# Altium schematic sheet TRANSFORMER_RJ45.SchDoc
size 386 x 246 mm
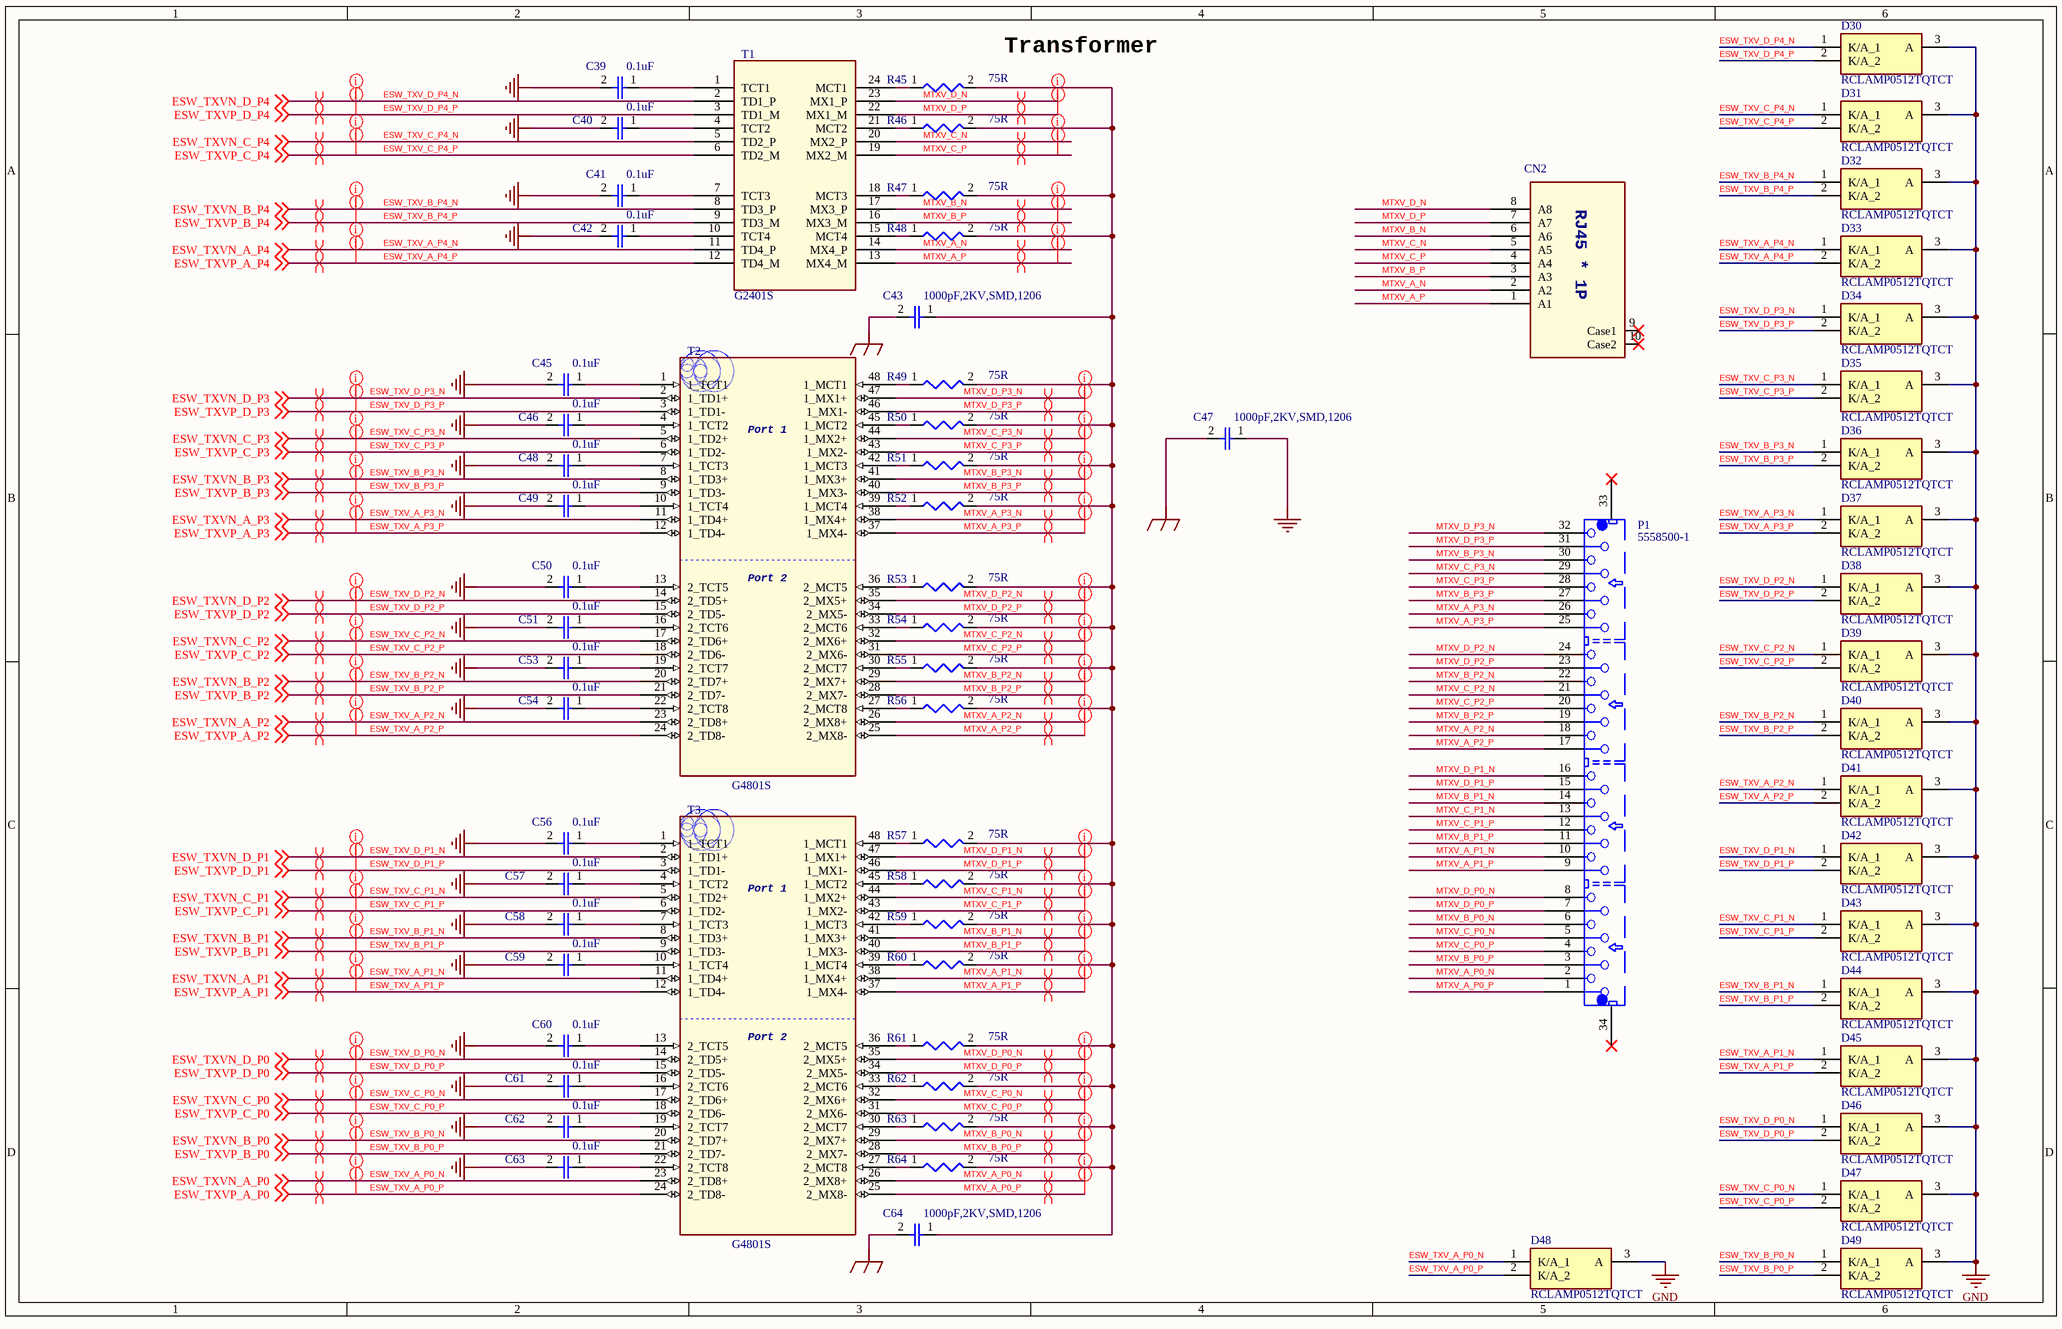
[diagram p0: TRANSFORMER_RJ45.SchDoc]

## Parts
C39  0.1uF  [0402-C]
C40  0.1uF  [0402-C]
C41  0.1uF  [0402-C]
C42  0.1uF  [0402-C]
C43  1000pF,2KV,SMD,1206  [1206-C]
C45  0.1uF  [0402-C]
C46  0.1uF  [0402-C]
C47  1000pF,2KV,SMD,1206  [1206-C]
C48  0.1uF  [0402-C]
C49  0.1uF  [0402-C]
C50  0.1uF  [0402-C]
C51  0.1uF  [0402-C]
C53  0.1uF  [0402-C]
C54  0.1uF  [0402-C]
C56  0.1uF  [0402-C]
C57  0.1uF  [0402-C]
C58  0.1uF  [0402-C]
C59  0.1uF  [0402-C]
C60  0.1uF  [0402-C]
C61  0.1uF  [0402-C]
C62  0.1uF  [0402-C]
C63  0.1uF  [0402-C]
C64  1000pF,2KV,SMD,1206  [1206-C]
CN2  6116518-1  [BEL_SS-6488-NF]  (value not drawn)
D30  RCLAMP0512TQTCT  [RCLAMP0512TQTCT]
D31  RCLAMP0512TQTCT  [RCLAMP0512TQTCT]
D32  RCLAMP0512TQTCT  [RCLAMP0512TQTCT]
D33  RCLAMP0512TQTCT  [RCLAMP0512TQTCT]
D34  RCLAMP0512TQTCT  [RCLAMP0512TQTCT]
D35  RCLAMP0512TQTCT  [RCLAMP0512TQTCT]
D36  RCLAMP0512TQTCT  [RCLAMP0512TQTCT]
D37  RCLAMP0512TQTCT  [RCLAMP0512TQTCT]
D38  RCLAMP0512TQTCT  [RCLAMP0512TQTCT]
D39  RCLAMP0512TQTCT  [RCLAMP0512TQTCT]
D40  RCLAMP0512TQTCT  [RCLAMP0512TQTCT]
D41  RCLAMP0512TQTCT  [RCLAMP0512TQTCT]
D42  RCLAMP0512TQTCT  [RCLAMP0512TQTCT]
D43  RCLAMP0512TQTCT  [RCLAMP0512TQTCT]
D44  RCLAMP0512TQTCT  [RCLAMP0512TQTCT]
D45  RCLAMP0512TQTCT  [RCLAMP0512TQTCT]
D46  RCLAMP0512TQTCT  [RCLAMP0512TQTCT]
D47  RCLAMP0512TQTCT  [RCLAMP0512TQTCT]
D48  RCLAMP0512TQTCT  [RCLAMP0512TQTCT]
D49  RCLAMP0512TQTCT  [RCLAMP0512TQTCT]
P1  5558500-1  [CONN_ARJ14A-MESA-MU2]
R45  75R  [0402-R]
R46  75R  [0402-R]
R47  75R  [0402-R]
R48  75R  [0402-R]
R49  75R  [0402-R]
R50  75R  [0402-R]
R51  75R  [0402-R]
R52  75R  [0402-R]
R53  75R  [0402-R]
R54  75R  [0402-R]
R55  75R  [0402-R]
R56  75R  [0402-R]
R57  75R  [0402-R]
R58  75R  [0402-R]
R59  75R  [0402-R]
R60  75R  [0402-R]
R61  75R  [0402-R]
R62  75R  [0402-R]
R63  75R  [0402-R]
R64  75R  [0402-R]
T1  G2401S  [SOP127P1600X572-24N]
T2  G4801S  [NV6]
T3  G4801S  [NV6]

## Nets
CHGND_GE_A: C43.2 C47.2 C64.2
GND: C39.2 C40.2 C41.2 C42.2 C45.2 C46.2 C47.1 C48.2 C49.2 C50.2 C51.2 C53.2 C54.2 C56.2 C57.2 C58.2 C59.2 C60.2 C61.2 C62.2 C63.2 D30.3(A) D31.3(A) D32.3(A) D33.3(A) D34.3(A) D35.3(A) D36.3(A) D37.3(A) D38.3(A) D39.3(A) D40.3(A) D41.3(A) D42.3(A) D43.3(A) D44.3(A) D45.3(A) D46.3(A) D47.3(A) D48.3(A) D49.3(A)
ESW_TXV_A_P0_N: D48.1(K/A_1) T3.23(2_TD8+) ; off-sheet ESW_TXVN_A_P0  [also labelled ESW_TXVN_A_P0]
ESW_TXV_A_P0_P: D48.2(K/A_2) T3.24(2_TD8-) ; off-sheet ESW_TXVP_A_P0  [also labelled ESW_TXVP_A_P0]
ESW_TXV_A_P1_N: D45.1(K/A_1) T3.11(1_TD4+) ; off-sheet ESW_TXVN_A_P1  [also labelled ESW_TXVN_A_P1]
ESW_TXV_A_P1_P: D45.2(K/A_2) T3.12(1_TD4-) ; off-sheet ESW_TXVP_A_P1  [also labelled ESW_TXVP_A_P1]
ESW_TXV_A_P2_N: D41.1(K/A_1) T2.23(2_TD8+) ; off-sheet ESW_TXVN_A_P2  [also labelled ESW_TXVN_A_P2]
ESW_TXV_A_P2_P: D41.2(K/A_2) T2.24(2_TD8-) ; off-sheet ESW_TXVP_A_P2  [also labelled ESW_TXVP_A_P2]
ESW_TXV_A_P3_N: D37.1(K/A_1) T2.11(1_TD4+) ; off-sheet ESW_TXVN_A_P3  [also labelled ESW_TXVN_A_P3]
ESW_TXV_A_P3_P: D37.2(K/A_2) T2.12(1_TD4-) ; off-sheet ESW_TXVP_A_P3  [also labelled ESW_TXVP_A_P3]
ESW_TXV_A_P4_N: D33.1(K/A_1) T1.11(TD4_P) ; off-sheet ESW_TXVN_A_P4  [also labelled ESW_TXVN_A_P4]
ESW_TXV_A_P4_P: D33.2(K/A_2) T1.12(TD4_M) ; off-sheet ESW_TXVP_A_P4  [also labelled ESW_TXVP_A_P4]
ESW_TXV_B_P0_N: D49.1(K/A_1) T3.20(2_TD7+) ; off-sheet ESW_TXVN_B_P0  [also labelled ESW_TXVN_B_P0]
ESW_TXV_B_P0_P: D49.2(K/A_2) T3.21(2_TD7-) ; off-sheet ESW_TXVP_B_P0  [also labelled ESW_TXVP_B_P0]
ESW_TXV_B_P1_N: D44.1(K/A_1) T3.8(1_TD3+) ; off-sheet ESW_TXVN_B_P1  [also labelled ESW_TXVN_B_P1]
ESW_TXV_B_P1_P: D44.2(K/A_2) T3.9(1_TD3-) ; off-sheet ESW_TXVP_B_P1  [also labelled ESW_TXVP_B_P1]
ESW_TXV_B_P2_N: D40.1(K/A_1) T2.20(2_TD7+) ; off-sheet ESW_TXVN_B_P2  [also labelled ESW_TXVN_B_P2]
ESW_TXV_B_P2_P: D40.2(K/A_2) T2.21(2_TD7-) ; off-sheet ESW_TXVP_B_P2  [also labelled ESW_TXVP_B_P2]
ESW_TXV_B_P3_N: D36.1(K/A_1) T2.8(1_TD3+) ; off-sheet ESW_TXVN_B_P3  [also labelled ESW_TXVN_B_P3]
ESW_TXV_B_P3_P: D36.2(K/A_2) T2.9(1_TD3-) ; off-sheet ESW_TXVP_B_P3  [also labelled ESW_TXVP_B_P3]
ESW_TXV_B_P4_N: D32.1(K/A_1) T1.8(TD3_P) ; off-sheet ESW_TXVN_B_P4  [also labelled ESW_TXVN_B_P4]
ESW_TXV_B_P4_P: D32.2(K/A_2) T1.9(TD3_M) ; off-sheet ESW_TXVP_B_P4  [also labelled ESW_TXVP_B_P4]
ESW_TXV_C_P0_N: D47.1(K/A_1) T3.17(2_TD6+) ; off-sheet ESW_TXVN_C_P0  [also labelled ESW_TXVN_C_P0]
ESW_TXV_C_P0_P: D47.2(K/A_2) T3.18(2_TD6-) ; off-sheet ESW_TXVP_C_P0  [also labelled ESW_TXVP_C_P0]
ESW_TXV_C_P1_N: D43.1(K/A_1) T3.5(1_TD2+) ; off-sheet ESW_TXVN_C_P1  [also labelled ESW_TXVN_C_P1]
ESW_TXV_C_P1_P: D43.2(K/A_2) T3.6(1_TD2-) ; off-sheet ESW_TXVP_C_P1  [also labelled ESW_TXVP_C_P1]
ESW_TXV_C_P2_N: D39.1(K/A_1) T2.17(2_TD6+) ; off-sheet ESW_TXVN_C_P2  [also labelled ESW_TXVN_C_P2]
ESW_TXV_C_P2_P: D39.2(K/A_2) T2.18(2_TD6-) ; off-sheet ESW_TXVP_C_P2  [also labelled ESW_TXVP_C_P2]
ESW_TXV_C_P3_N: D35.1(K/A_1) T2.5(1_TD2+) ; off-sheet ESW_TXVN_C_P3  [also labelled ESW_TXVN_C_P3]
ESW_TXV_C_P3_P: D35.2(K/A_2) T2.6(1_TD2-) ; off-sheet ESW_TXVP_C_P3  [also labelled ESW_TXVP_C_P3]
ESW_TXV_C_P4_N: D31.1(K/A_1) T1.5(TD2_P) ; off-sheet ESW_TXVN_C_P4  [also labelled ESW_TXVN_C_P4]
ESW_TXV_C_P4_P: D31.2(K/A_2) T1.6(TD2_M) ; off-sheet ESW_TXVP_C_P4  [also labelled ESW_TXVP_C_P4]
ESW_TXV_D_P0_N: D46.1(K/A_1) T3.14(2_TD5+) ; off-sheet ESW_TXVN_D_P0  [also labelled ESW_TXVN_D_P0]
ESW_TXV_D_P0_P: D46.2(K/A_2) T3.15(2_TD5-) ; off-sheet ESW_TXVP_D_P0  [also labelled ESW_TXVP_D_P0]
ESW_TXV_D_P1_N: D42.1(K/A_1) T3.2(1_TD1+) ; off-sheet ESW_TXVN_D_P1  [also labelled ESW_TXVN_D_P1]
ESW_TXV_D_P1_P: D42.2(K/A_2) T3.3(1_TD1-) ; off-sheet ESW_TXVP_D_P1  [also labelled ESW_TXVP_D_P1]
ESW_TXV_D_P2_N: D38.1(K/A_1) T2.14(2_TD5+) ; off-sheet ESW_TXVN_D_P2  [also labelled ESW_TXVN_D_P2]
ESW_TXV_D_P2_P: D38.2(K/A_2) T2.15(2_TD5-) ; off-sheet ESW_TXVP_D_P2  [also labelled ESW_TXVP_D_P2]
ESW_TXV_D_P3_N: D34.1(K/A_1) T2.2(1_TD1+) ; off-sheet ESW_TXVN_D_P3  [also labelled ESW_TXVN_D_P3]
ESW_TXV_D_P3_P: D34.2(K/A_2) T2.3(1_TD1-) ; off-sheet ESW_TXVP_D_P3  [also labelled ESW_TXVP_D_P3]
ESW_TXV_D_P4_N: D30.1(K/A_1) T1.2(TD1_P) ; off-sheet ESW_TXVN_D_P4  [also labelled ESW_TXVN_D_P4]
ESW_TXV_D_P4_P: D30.2(K/A_2) T1.3(TD1_M) ; off-sheet ESW_TXVP_D_P4  [also labelled ESW_TXVP_D_P4]
MTXV_A_N: CN2.2(A2) T1.14(MX4_P)
MTXV_A_P: CN2.1(A1) T1.13(MX4_M)
MTXV_A_P0_N: P1.2 T3.26(2_MX8+)
MTXV_A_P0_P: P1.1 T3.25(2_MX8-)
MTXV_A_P1_N: P1.10 T3.38(1_MX4+)
MTXV_A_P1_P: P1.9 T3.37(1_MX4-)
MTXV_A_P2_N: P1.18 T2.26(2_MX8+)
MTXV_A_P2_P: P1.17 T2.25(2_MX8-)
MTXV_A_P3_N: P1.26 T2.38(1_MX4+)
MTXV_A_P3_P: P1.25 T2.37(1_MX4-)
MTXV_B_N: CN2.6(A6) T1.17(MX3_P)
MTXV_B_P: CN2.3(A3) T1.16(MX3_M)
MTXV_B_P0_N: P1.6 T3.29(2_MX7+)
MTXV_B_P0_P: P1.3 T3.28(2_MX7-)
MTXV_B_P1_N: P1.14 T3.41(1_MX3+)
MTXV_B_P1_P: P1.11 T3.40(1_MX3-)
MTXV_B_P2_N: P1.22 T2.29(2_MX7+)
MTXV_B_P2_P: P1.19 T2.28(2_MX7-)
MTXV_B_P3_N: P1.30 T2.41(1_MX3+)
MTXV_B_P3_P: P1.27 T2.40(1_MX3-)
MTXV_C_N: CN2.5(A5) T1.20(MX2_P)
MTXV_C_P: CN2.4(A4) T1.19(MX2_M)
MTXV_C_P0_N: P1.5 T3.32(2_MX6+)
MTXV_C_P0_P: P1.4 T3.31(2_MX6-)
MTXV_C_P1_N: P1.13 T3.44(1_MX2+)
MTXV_C_P1_P: P1.12 T3.43(1_MX2-)
MTXV_C_P2_N: P1.21 T2.32(2_MX6+)
MTXV_C_P2_P: P1.20 T2.31(2_MX6-)
MTXV_C_P3_N: P1.29 T2.44(1_MX2+)
MTXV_C_P3_P: P1.28 T2.43(1_MX2-)
MTXV_D_N: CN2.8(A8) T1.23(MX1_P)
MTXV_D_P: CN2.7(A7) T1.22(MX1_M)
MTXV_D_P0_N: P1.8 T3.35(2_MX5+)
MTXV_D_P0_P: P1.7 T3.34(2_MX5-)
MTXV_D_P1_N: P1.16 T3.47(1_MX1+)
MTXV_D_P1_P: P1.15 T3.46(1_MX1-)
MTXV_D_P2_N: P1.24 T2.35(2_MX5+)
MTXV_D_P2_P: P1.23 T2.34(2_MX5-)
MTXV_D_P3_N: P1.32 T2.47(1_MX1+)
MTXV_D_P3_P: P1.31 T2.46(1_MX1-)
NetC39_1: C39.1 T1.1(TCT1)
NetC40_1: C40.1 T1.4(TCT2)
NetC41_1: C41.1 T1.7(TCT3)
NetC42_1: C42.1 T1.10(TCT4)
NetC43_1: C43.1 C64.1 R45.2 R46.2 R47.2 R48.2 R49.2 R50.2 R51.2 R52.2 R53.2 R54.2 R55.2 R56.2 R57.2 R58.2 R59.2 R60.2 R61.2 R62.2 R63.2 R64.2
NetC45_1: C45.1 T2.1(1_TCT1)
NetC46_1: C46.1 T2.4(1_TCT2)
NetC48_1: C48.1 T2.7(1_TCT3)
NetC49_1: C49.1 T2.10(1_TCT4)
NetC50_1: C50.1 T2.13(2_TCT5)
NetC51_1: C51.1 T2.16(2_TCT6)
NetC53_1: C53.1 T2.19(2_TCT7)
NetC54_1: C54.1 T2.22(2_TCT8)
NetC56_1: C56.1 T3.1(1_TCT1)
NetC57_1: C57.1 T3.4(1_TCT2)
NetC58_1: C58.1 T3.7(1_TCT3)
NetC59_1: C59.1 T3.10(1_TCT4)
NetC60_1: C60.1 T3.13(2_TCT5)
NetC61_1: C61.1 T3.16(2_TCT6)
NetC62_1: C62.1 T3.19(2_TCT7)
NetC63_1: C63.1 T3.22(2_TCT8)
NetR45_1: R45.1 T1.24(MCT1)
NetR46_1: R46.1 T1.21(MCT2)
NetR47_1: R47.1 T1.18(MCT3)
NetR48_1: R48.1 T1.15(MCT4)
NetR49_1: R49.1 T2.48(1_MCT1)
NetR50_1: R50.1 T2.45(1_MCT2)
NetR51_1: R51.1 T2.42(1_MCT3)
NetR52_1: R52.1 T2.39(1_MCT4)
NetR53_1: R53.1 T2.36(2_MCT5)
NetR54_1: R54.1 T2.33(2_MCT6)
NetR55_1: R55.1 T2.30(2_MCT7)
NetR56_1: R56.1 T2.27(2_MCT8)
NetR57_1: R57.1 T3.48(1_MCT1)
NetR58_1: R58.1 T3.45(1_MCT2)
NetR59_1: R59.1 T3.42(1_MCT3)
NetR60_1: R60.1 T3.39(1_MCT4)
NetR61_1: R61.1 T3.36(2_MCT5)
NetR62_1: R62.1 T3.33(2_MCT6)
NetR63_1: R63.1 T3.30(2_MCT7)
NetR64_1: R64.1 T3.27(2_MCT8)

Not connected (* = marked no-connect by the designer): CN2 9(Case1)* 10(Case2)*; P1 33* 34*

## Layout directives
differential pair; differential pair class DIFF100: ESW_TXV_A_P0_N, ESW_TXV_A_P0_P, ESW_TXV_A_P1_N, ESW_TXV_A_P1_P, ESW_TXV_A_P2_N, ESW_TXV_A_P2_P, ESW_TXV_A_P3_N, ESW_TXV_A_P3_P, ESW_TXV_A_P4_N, ESW_TXV_A_P4_P, ESW_TXV_B_P0_N, ESW_TXV_B_P0_P, ESW_TXV_B_P1_N, ESW_TXV_B_P1_P, ESW_TXV_B_P2_N, ESW_TXV_B_P2_P, ESW_TXV_B_P3_N, ESW_TXV_B_P3_P, ESW_TXV_B_P4_N, ESW_TXV_B_P4_P, ESW_TXV_C_P0_N, ESW_TXV_C_P0_P, ESW_TXV_C_P1_N, ESW_TXV_C_P1_P, ESW_TXV_C_P2_N, ESW_TXV_C_P2_P, ESW_TXV_C_P3_N, ESW_TXV_C_P3_P, ESW_TXV_C_P4_N, ESW_TXV_C_P4_P, ESW_TXV_D_P0_N, ESW_TXV_D_P0_P, ESW_TXV_D_P1_N, ESW_TXV_D_P1_P, ESW_TXV_D_P2_N, ESW_TXV_D_P2_P, ESW_TXV_D_P3_N, ESW_TXV_D_P3_P, ESW_TXV_D_P4_N, ESW_TXV_D_P4_P, MTXV_A_N, MTXV_A_P, MTXV_A_P0_N, MTXV_A_P0_P, MTXV_A_P1_N, MTXV_A_P1_P, MTXV_A_P2_N, MTXV_A_P2_P, MTXV_A_P3_N, MTXV_A_P3_P, MTXV_B_N, MTXV_B_P, MTXV_B_P0_N, MTXV_B_P0_P, MTXV_B_P1_N, MTXV_B_P1_P, MTXV_B_P2_N, MTXV_B_P2_P, MTXV_B_P3_N, MTXV_B_P3_P, MTXV_C_N, MTXV_C_P, MTXV_C_P0_N, MTXV_C_P0_P, MTXV_C_P1_N, MTXV_C_P1_P, MTXV_C_P2_N, MTXV_C_P2_P, MTXV_C_P3_N, MTXV_C_P3_P, MTXV_D_N, MTXV_D_P, MTXV_D_P0_N, MTXV_D_P0_P, MTXV_D_P1_N, MTXV_D_P1_P, MTXV_D_P2_N, MTXV_D_P2_P, MTXV_D_P3_N, MTXV_D_P3_P
rule Matched Net Lengths [Tolerance = 100mil]: ESW_TXV_A_P0_N, ESW_TXV_A_P0_P, ESW_TXV_A_P1_N, ESW_TXV_A_P1_P, ESW_TXV_A_P2_N, ESW_TXV_A_P2_P, ESW_TXV_A_P3_N, ESW_TXV_A_P3_P, ESW_TXV_A_P4_N, ESW_TXV_A_P4_P, ESW_TXV_B_P0_N, ESW_TXV_B_P0_P, ESW_TXV_B_P1_N, ESW_TXV_B_P1_P, ESW_TXV_B_P2_N, ESW_TXV_B_P2_P, ESW_TXV_B_P3_N, ESW_TXV_B_P3_P, ESW_TXV_B_P4_N, ESW_TXV_B_P4_P, ESW_TXV_C_P0_N, ESW_TXV_C_P0_P, ESW_TXV_C_P1_N, ESW_TXV_C_P1_P, ESW_TXV_C_P2_N, ESW_TXV_C_P2_P, ESW_TXV_C_P3_N, ESW_TXV_C_P3_P, ESW_TXV_C_P4_N, ESW_TXV_C_P4_P, ESW_TXV_D_P0_N, ESW_TXV_D_P0_P, ESW_TXV_D_P1_N, ESW_TXV_D_P1_P, ESW_TXV_D_P2_N, ESW_TXV_D_P2_P, ESW_TXV_D_P3_N, ESW_TXV_D_P3_P, ESW_TXV_D_P4_N, ESW_TXV_D_P4_P, MTXV_A_N, MTXV_A_P, MTXV_A_P0_N, MTXV_A_P0_P, MTXV_A_P1_N, MTXV_A_P1_P, MTXV_A_P2_N, MTXV_A_P2_P, MTXV_A_P3_N, MTXV_A_P3_P, MTXV_B_N, MTXV_B_P, MTXV_B_P0_N, MTXV_B_P0_P, MTXV_B_P1_N, MTXV_B_P1_P, MTXV_B_P2_N, MTXV_B_P2_P, MTXV_B_P3_N, MTXV_B_P3_P, MTXV_C_N, MTXV_C_P, MTXV_C_P0_N, MTXV_C_P0_P, MTXV_C_P1_N, MTXV_C_P1_P, MTXV_C_P2_N, MTXV_C_P2_P, MTXV_C_P3_N, MTXV_C_P3_P, MTXV_D_N, MTXV_D_P, MTXV_D_P0_N, MTXV_D_P0_P, MTXV_D_P1_N, MTXV_D_P1_P, MTXV_D_P2_N, MTXV_D_P2_P, MTXV_D_P3_N, MTXV_D_P3_P

## Notes on the sheet
- (near R45) Transformer
- (in symbol 6116518-1) RJ45 * 1P
- (in symbol G4801S) Port 1; Port 2

## Library data of the parts
C39-C43 C45-C51 C53 C54 C56-C64 = CAP
D30-D49 = RCLAMP0512TQTCT: Diode; Manufacturer_Name: SEMTECH; Datasheet Link: https://media.digikey.com/pdf/Data%20Sheets/Semtech%20PDFs/RCLAMP0512TQ_Rev6_12-17-15.pdf; Height: 0.45mm; Manufacturer_Part_Number: RCLAMP0512TQTCT; Mouser Part Number: 947-RCLAMP0512TQTCT; Mouser Price/Stock: https://www.mouser.co.uk/ProductDetail/Semtech/RCLAMP0512TQTCT?qs=rBWM4%252BvDhIfq7vcNOg1BvQ%3D%3D; Arrow Part Number: RCLAMP0512TQTCT; Arrow Price/Stock: https://www.arrow.com/en/products/rclamp0512tqtct/semtech?region=europe
R45-R64 = Res
T1 = G2401S: Audio Transformers / Signal Transformers 1000BaseT SMD NonPoE 350uH .65Ohms 1-Por
T2 T3 = G4801S: Audio Transformers / Signal Transformers GIGABIT ISO MOD SMD 48P 2-Port w/Choke